# Altium schematic sheet chess_module.SchDoc
size A; SheetNumber: 1; SheetTotal: 1
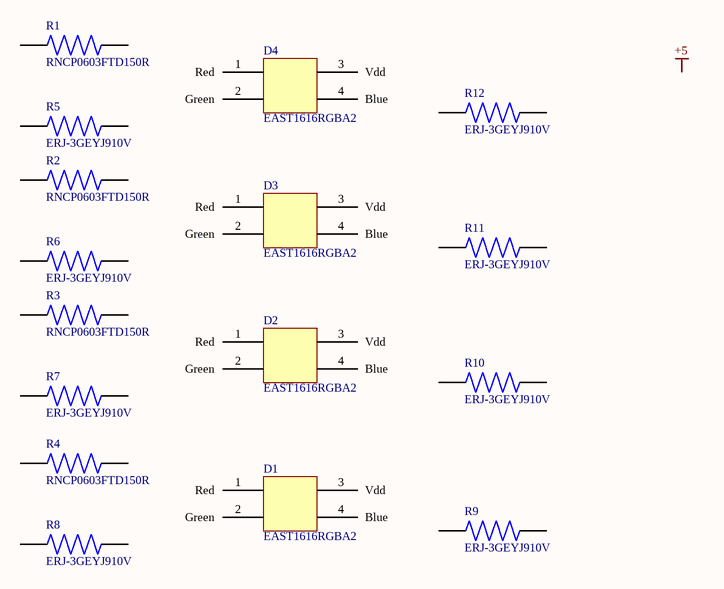
[diagram p0: chess_module.SchDoc]

## Parts
D1  EAST1616RGBA2  [EAST1616RGBA2]
D2  EAST1616RGBA2  [EAST1616RGBA2]
D3  EAST1616RGBA2  [EAST1616RGBA2]
D4  EAST1616RGBA2  [EAST1616RGBA2]
R1  RNCP0603FTD150R  [RESC1508X50N]
R2  RNCP0603FTD150R  [RESC1508X50N]
R3  RNCP0603FTD150R  [RESC1508X50N]
R4  RNCP0603FTD150R  [RESC1508X50N]
R5  ERJ-3GEYJ910V  [RESC1608X55N]
R6  ERJ-3GEYJ910V  [RESC1608X55N]
R7  ERJ-3GEYJ910V  [RESC1608X55N]
R8  ERJ-3GEYJ910V  [RESC1608X55N]
R9  ERJ-3GEYJ910V  [RESC1608X55N]
R10  ERJ-3GEYJ910V  [RESC1608X55N]
R11  ERJ-3GEYJ910V  [RESC1608X55N]
R12  ERJ-3GEYJ910V  [RESC1608X55N]

## Nets

Not connected (* = marked no-connect by the designer): D1 1(Red) 2(Green) 3(Vdd) 4(Blue); D2 1(Red) 2(Green) 3(Vdd) 4(Blue); D3 1(Red) 2(Green) 3(Vdd) 4(Blue); D4 1(Red) 2(Green) 3(Vdd) 4(Blue); R1 1 2; R2 1 2; R3 1 2; R4 1 2; R5 1 2; R6 1 2; R7 1 2; R8 1 2; R9 1 2; R10 1 2; R11 1 2; R12 1 2

## Notes on the sheet
- Labels drawn without touching a wire or pin: +5

## Library data of the parts
R5-R12 = ERJ-3GEYJ910V: Res Thick Film 0603 91 Ohm 5% 1/10W Ã‚Â±200ppm/Ã‚Â°C Molded SMD SMD Punched Carrier T/R; Package: None; Price: None; Value: *; MP: ERJ-3GEYJ910V; Availability: Unavailable
R1-R4 = RNCP0603FTD150R: Package: None; Price: None; Value: *; MP: RNCP0603FTD150R; Availability: Unavailable